# Altium schematic sheet OSCILLAR_HFB_V1p0_MECH.SchDoc
size A4; SheetNumber: 7; SheetTotal: 8
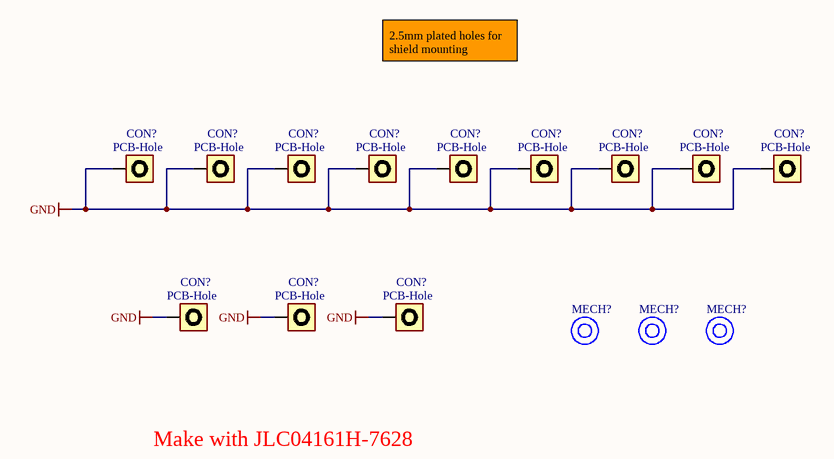
[diagram p0: OSCILLAR_HFB_V1p0_MECH.SchDoc]

## Parts
(Parts that share a designator on the sheet are numbered #1, #2 ... from top to bottom, then left to right.)
CON?#1  PCB-Hole  [M2.5_PAD2]
CON?#2  PCB-Hole  [M2.5_PAD2]
CON?#3  PCB-Hole  [M2.5_PAD2]
CON?#4  PCB-Hole  [M2.5_PAD2]
CON?#5  PCB-Hole  [M2.5_PAD2]
CON?#6  PCB-Hole  [M2.5_PAD2]
CON?#7  PCB-Hole  [M2.5_PAD2]
CON?#8  PCB-Hole  [M2.5_PAD2]
CON?#9  PCB-Hole  [M2.5_PAD2]
CON?#10  PCB-Hole  [M2.5_PAD2]  (no BOM)
CON?#11  PCB-Hole  [M2.5_PAD2]  (no BOM)
CON?#12  PCB-Hole  [M2.5_PAD2]  (no BOM)
MECH?#1  Fiducial  [FIDU_1MM]  (value not drawn)  (no BOM)
MECH?#2  Fiducial  [FIDU_1MM]  (value not drawn)  (no BOM)
MECH?#3  Fiducial  [FIDU_1MM]  (value not drawn)  (no BOM)

## Nets
GND: CON?#1.1 CON?#2.1 CON?#3.1 CON?#4.1 CON?#5.1 CON?#6.1 CON?#7.1 CON?#8.1 CON?#9.1 CON?#10.1 CON?#11.1 CON?#12.1

## Notes on the sheet
- 2.5mm plated holes for shield mounting
- Make with JLC04161H-7628
- Board:
- Author:
- Title:
- Project:
- SVN:
- Version:
- Sheet:
- of
- Contact:
- Modified:
- Size:
- A4

## Library data of the parts
CON?#1-CON?#12 = PCB-Hole: PCB hole
MECH?#1-MECH?#3 = FIDU: Fiducatial, round, 1mm